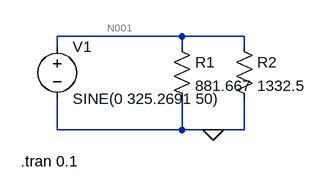
[diagram p0: schematic Draft4.asc]
Draft4.asc, the LTspice schematic file:
Version 4
SHEET 1 880 680
WIRE 160 112 -32 112
WIRE 256 112 160 112
WIRE -32 128 -32 112
WIRE 160 128 160 112
WIRE 256 128 256 112
WIRE -32 256 -32 208
WIRE 160 256 160 208
WIRE 160 256 -32 256
WIRE 208 256 160 256
WIRE 256 256 256 208
WIRE 256 256 208 256
FLAG 208 256 0
SYMBOL voltage -32 112 R0
WINDOW 123 0 0 Left 2
WINDOW 39 0 0 Left 2
SYMATTR InstName V1
SYMATTR Value SINE(0 325.2691 50)
SYMBOL res 144 112 R0
SYMATTR InstName R1
SYMATTR Value 881.667
SYMBOL res 240 112 R0
SYMATTR InstName R2
SYMATTR Value 1332.5
TEXT -88 304 Left 2 !.tran 0.1

The netlist it stands for:
* Draft4.asc
V1 N001 0 SINE(0 325.2691 50)
R1 N001 0 881.667
R2 N001 0 1332.5
.tran 0.1
.backanno
.end

* Results of the author's LTspice run, read from the files saved beside the schematic
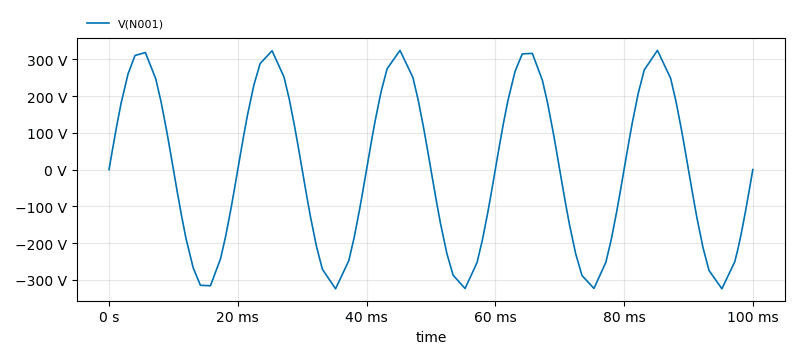
[diagram p1: Transient Analysis of Draft4.asc, plotted from the saved traces]
* Transient Analysis, 1 run:
*   V(N001): min -324.3 V, max 324.3 V, average 84.19 mV, rms 226.4 V, last 0 V